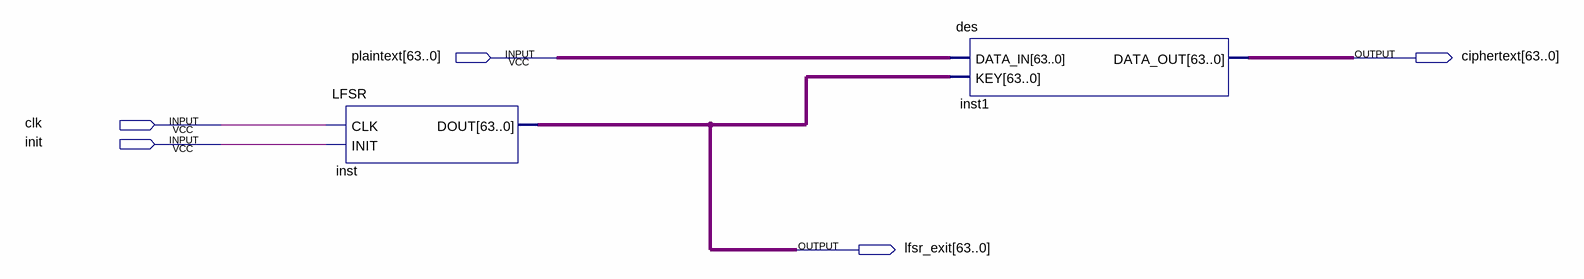
[diagram p0: schematic sheet]
// Quartus schematic MUC_PROJECT.bdf as structural Verilog: 2 symbols, 5 pins
module MUC_PROJECT (
  input  [63:0] plaintext,
  input  clk,
  input  init,
  output [63:0] ciphertext,
  output [63:0] lfsr_exit
);

  LFSR inst (.CLK(clk), .INIT(init), .DOUT(lfsr_exit));
  des inst1 (.DATA_IN(plaintext), .KEY(lfsr_exit), .DATA_OUT(ciphertext));
endmodule
